# Altium schematic sheet RS232.SchDoc
size A3; SheetNumber: 5; SheetTotal: 10
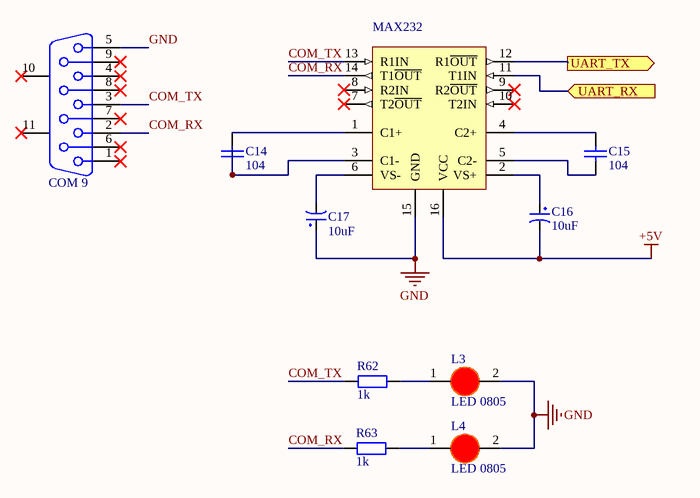
[diagram p0: RS232.SchDoc]

## Parts
C14  104  [tu 0805]
C15  104  [tu 0805]
C16  10uF  [tu hoa 4mm]
C17  10uF  [tu hoa 4mm]
COM1  COM 9  [DSB 9-F]
IC4  MAX232  [MAX-232]
L3  LED 0805  [LED-0805-Red]
L4  LED 0805  [LED-0805-Red]
R62  1k  [tro smd 0805]
R63  1k  [tro smd 0805]

## Ports
UART_RX (in), UART_TX (out)

## Nets
+5V: C16.2 IC4.16(VCC)
GND: C17.1 COM1.5 IC4.15(GND) L3.2(K) L4.2(K)
COM_RX: COM1.2 IC4.14(T1~{OUT}) R63.1
COM_TX: COM1.3 IC4.13(R1IN) R62.1
UART_RX: IC4.11(T1IN) ; port UART_RX
UART_TX: IC4.12(R1~{OUT}) ; port UART_TX
NetC14_1: C14.1 IC4.1(C1+)
NetC14_2: C14.2 IC4.3(C1-)
NetC15_1: C15.1 IC4.4(C2+)
NetC15_2: C15.2 IC4.5(C2-)
NetC16_1: C16.1 IC4.2(VS+)
NetC17_2: C17.2 IC4.6(VS-)
NetL3_1: L3.1(A) R62.2
NetL4_1: L4.1(A) R63.2

Not connected (* = marked no-connect by the designer): COM1 1* 4* 6* 7* 8* 9* 10(MH1)* 11(MH2)*; IC4 7(T2~{OUT})* 8(R2IN)* 9(R2~{OUT})* 10(T2IN)*

## Library data of the parts
C14 C15 = Tu 0805 104 50V 10%: Dán; Don_Vi: Con; So_Chan: 2; Ten_Linh_Kien: Tụ 0805 104-100nF 10% 50V; Ma_Hang: MH004551; Chung_Loai: Dán; Kieu_Chan: *
C16 C17 = Tu Hoa 10uF 25V 4x7: Cắm; So_Chan: 2; Ten_Linh_Kien: Tụ Hóa 10uF 25V 4x7MM; Don_Vi: Con; Ma_Hang: MH001349; Chung_Loai: Cắm; Kieu_Chan: *
COM1 = COM 9 DSB: PackageDocument: O; Positions: 9; Gender: Receptacle; Published: 15-Jun-2001; LatestRevisionDate: 17-Jul-2002; LatestRevisionNote: Re-released for DXP Platform.; DatasheetDocument: 1-Sep-1999; PackageReference: 788750; Publisher: Altium Limited; Orientation: Right Angle; Value: COM 9
IC4 = MAX232: Dual EIA-232 Driver/Receiver; Value: MAX232
L3 L4 = LED 0805 Do: Dán; Don_Vi: Con; Ma_Hang: MH000897; Ten_Linh_Kien: LED 0805 Màu Đỏ (Red); Ghi_Chu: *; Kieu_Chan: *; Chung_Loai: Dán
R62 R63 = Tro 0805 1% 1k: Dán; Don_Vi: Con; So_Chan: 2; Ten_Linh_Kien: Trở 0805 1% 1k; Ma_Hang: MH005468; Chung_Loai: Dán; Kieu_Chan: *